# EasyEDA schematic 1-Schematic_TRIAC Dimmer.json
TITLE: Sheet_1; REV: 1.0; Date: 2021-07-04; Sheet: 1/1; Drawn By: Manuel Covas; Company: Your Company
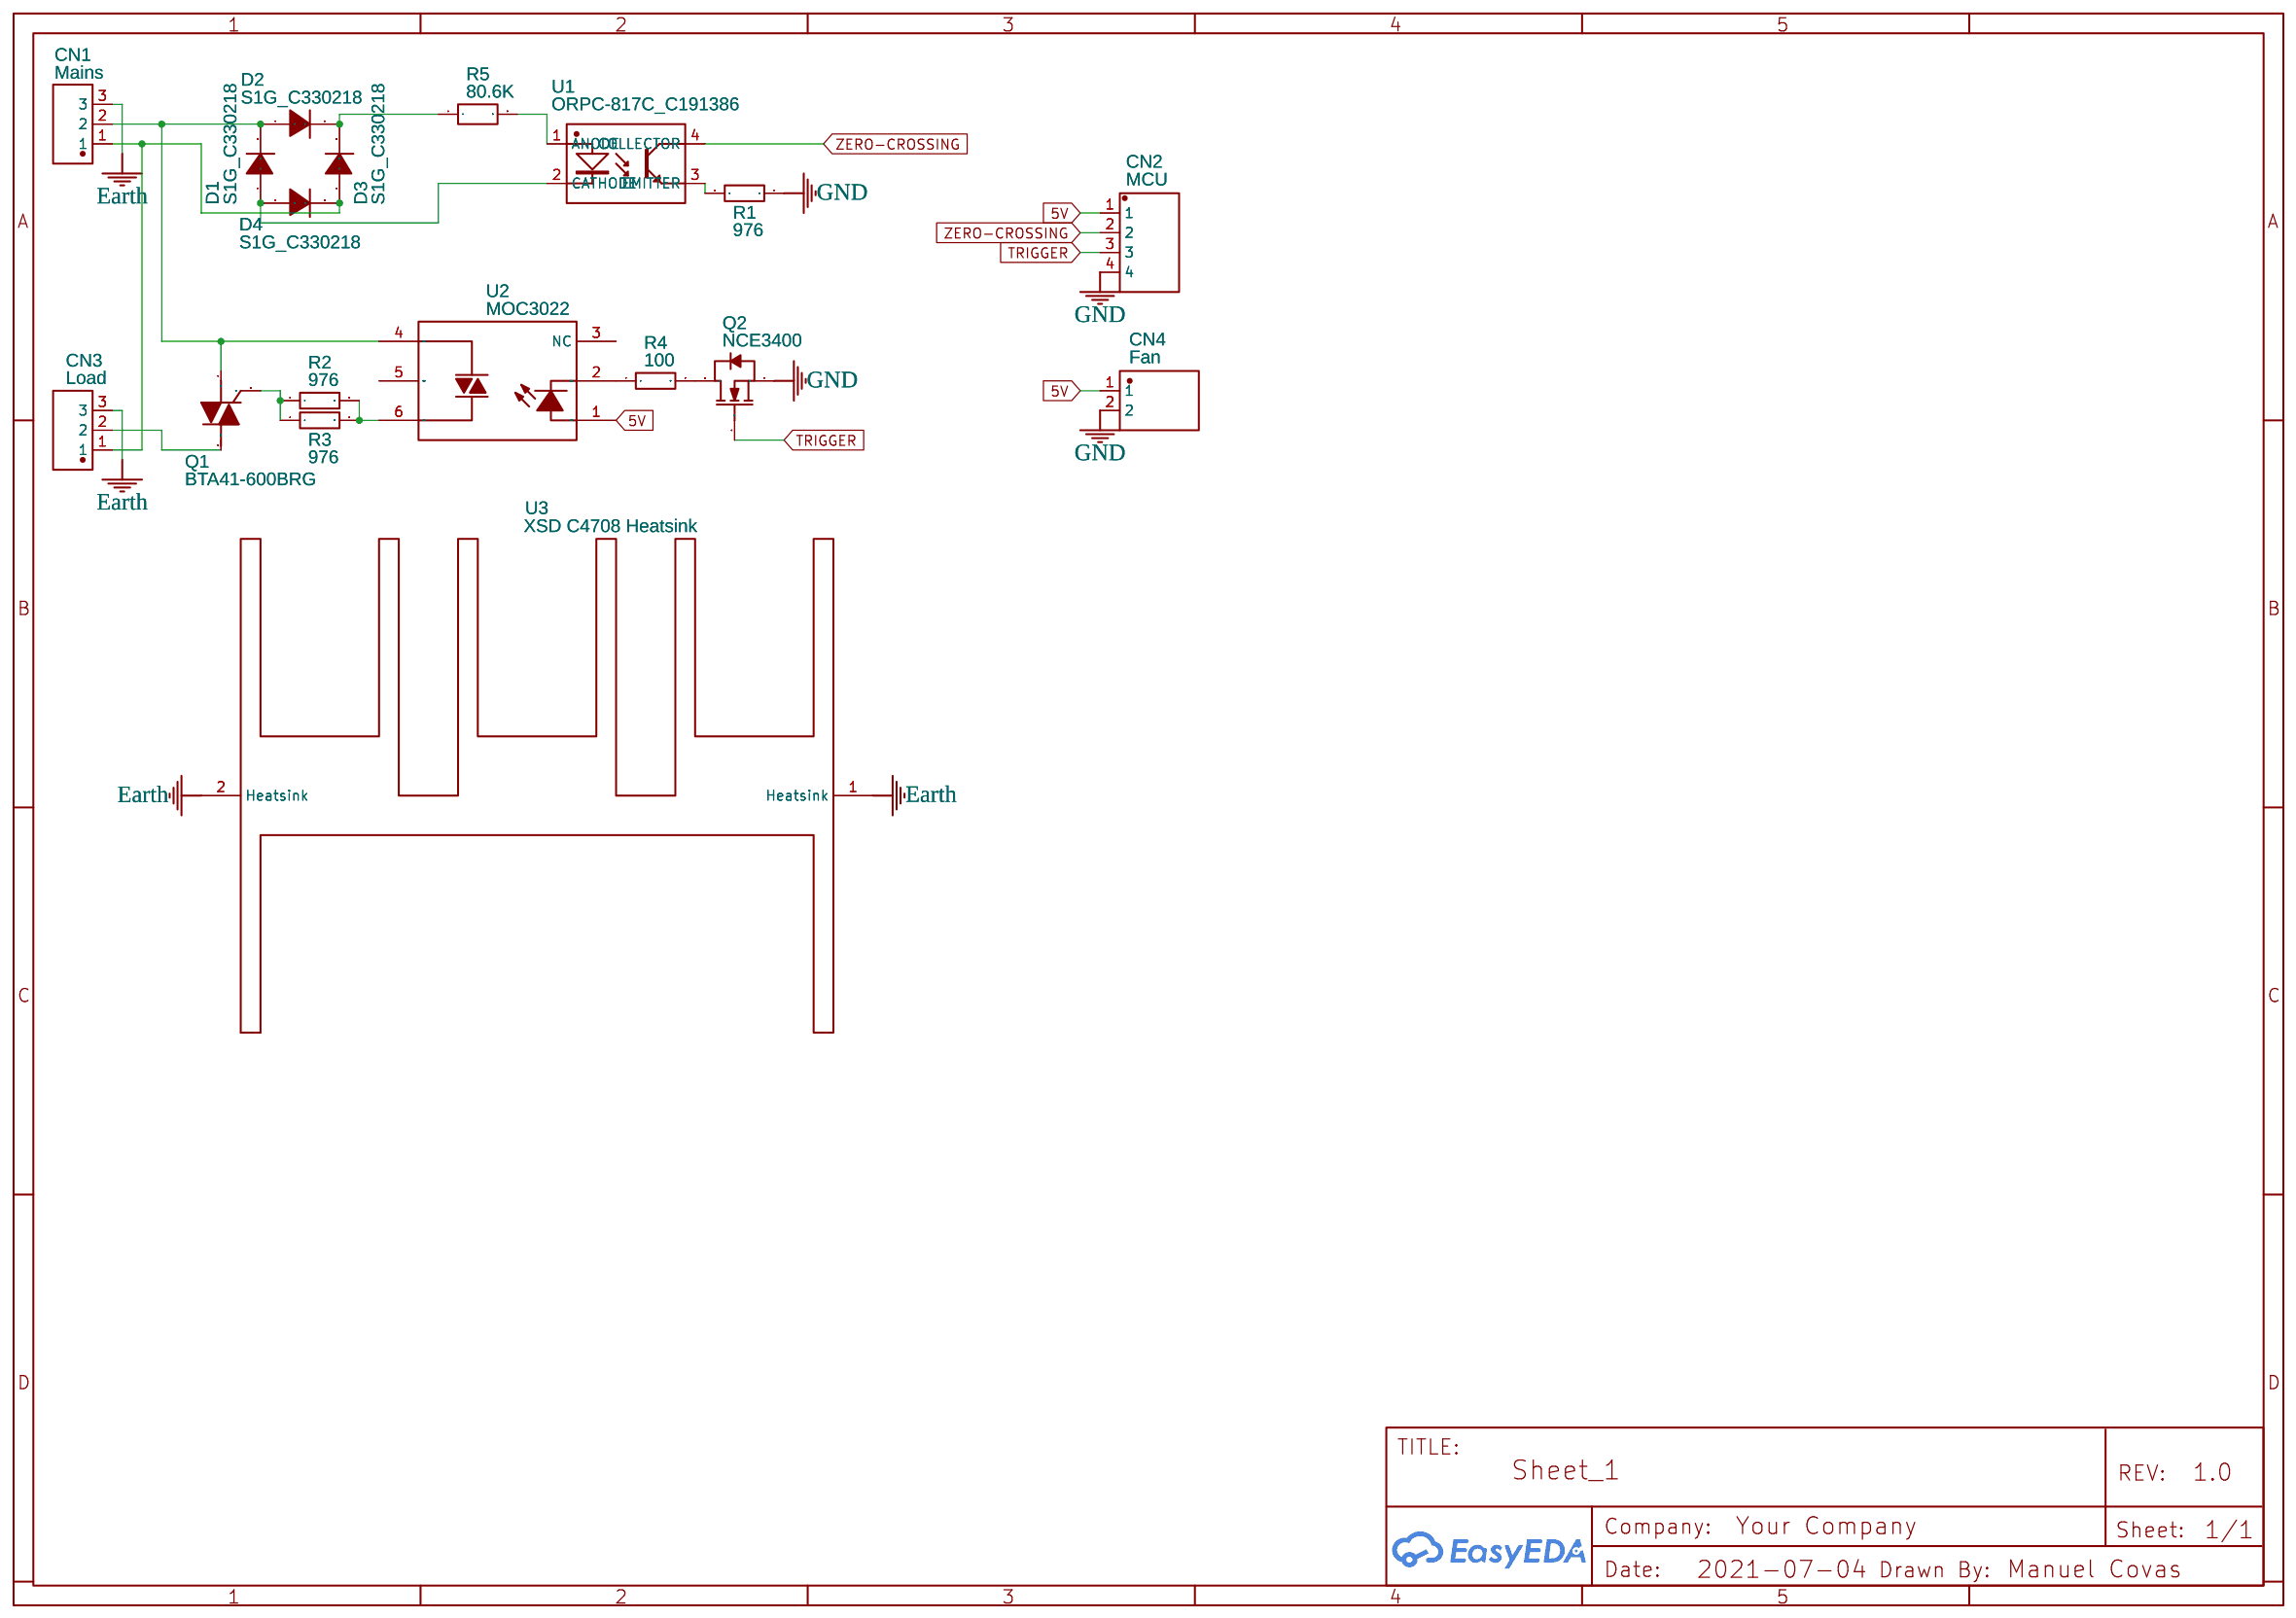
[diagram p0: schematic sheet]

## Parts
CN1  Mains  [CONN-TH_3P-P5.00_KF301-5.0-3P]
CN2  MCU  [CONN-TH_B4B-XH-AM-LF-SN]
CN3  Load  [CONN-TH_3P-P5.00_KF301-5.0-3P]
CN4  Fan  [CONN-TH_B2B-XH-AM-LF-SN]
D1  S1G_C330218  [SMA_L4.3-W2.6-LS5.2-FD]
D2  S1G_C330218  [SMA_L4.3-W2.6-LS5.2-FD]
D3  S1G_C330218  [SMA_L4.3-W2.6-LS5.2-FD]
D4  S1G_C330218  [SMA_L4.3-W2.6-LS5.2-FD]
Q1  BTA41-600BRG  [TOP3_L15.3-W4.5-P5.60-L]
Q2  NCE3400  [SOT-23-3_L2.9-W1.6-P1.90-LS2.8-BR]
R1  976  [R1206]
R2  976  [R1206]
R3  976  [R1206]
R4  100  [R0805]
R5  80.6K  [R2512]
U1  ORPC-817C_C191386  [DIP-4_L6.4-W4.6-P2.54-LS7.6-BL]
U2  MOC3022  [DIP-6_L7.1-W6.5-P2.54-LS7.6-BL]
U3  XSD C4708 Heatsink  [XSD C4708 HEATSINK]

## Library data of the parts
CN1 CN3 = KF301-5.0-3P: Supplier: LCSC; Supplier Part: C474882; Manufacturer: Cixi Kefa Elec; Contributor: LCSC; JLCPCB Part Class: Extended Part
CN2 = B4B-XH-AM(LF)(SN): Supplier: LCSC; Supplier Part: C161871; Manufacturer: JST Sales America; Contributor: LCSC; JLCPCB Part Class: Extended Part
CN4 = B2B-XH-AM (LF)(SN): Supplier: LCSC; Supplier Part: C161869; Manufacturer: JST Sales America; Contributor: LCSC; JLCPCB Part Class: Extended Part
D1-D4 = S1G_C330218: Supplier: LCSC; Supplier Part: C330218; Manufacturer: LGE; Contributor: LCSC; JLCPCB Part Class: Extended Part
Q1 = BTA41-600BRG: Supplier: LCSC; Manufacturer: STMicroelectronics; Contributor: LCSC; Supplier Part: C9103; JLCPCB Part Class: Extended Part
Q2 = NCE3400: Supplier: LCSC; Manufacturer: Ncepower; Supplier Part: C113202; JLCPCB Part Class: Extended Part
R1-R3 = AC1206FR-07976RL: Supplier: LCSC; Supplier Part: C229856; Manufacturer: YAGEO; Contributor: LCSC; JLCPCB Part Class: Extended Part
R4 = RMC1/10K101FTP: Supplier: LCSC; Supplier Part: C340501; Manufacturer: KAMAYA; Contributor: LCSC
R5 = 25121WF8062T4E: Supplier: LCSC; Supplier Part: C406917; Manufacturer: Uniroyal Elec; Contributor: LCSC
U1 = ORPC-817C_C191386: Supplier: LCSC; Supplier Part: C191386; Manufacturer: Orient; Manufacturer Part: ORPC-817C; Contributor: LCSC; JLCPCB Part Class: Extended Part
U2 = MOC3022: Supplier: LCSC; Manufacturer: LITEON; Contributor: LCSC; Supplier Part: C115466; JLCPCB Part Class: Extended Part
U3 = XSD C4708 Heatsink: Manufacturer: XSD; Manufacturer Part: C4708; Supplier: LCSC; Supplier Part: C4708; link: https://lcsc.com/product-detail/Heat-Sinks_XSD-30-25-25-True-color1Hole-heat-sink_C4708.html; Contributor: Manuel Covas

## Nets
5V: CN2.1 CN4.1 U2.1(ANODE)
GND: CN2.4 CN4.2 Q2.2(S) R1.1
Earth: CN1.3 CN3.3 U3.1(Heatsink) U3.2(Heatsink)
TRIGGER: CN2.3 Q2.1(G)
ZERO-CROSSING: CN2.2 U1.4(COLLECTOR)
Net-(CN1-1): CN1.1 CN3.1 D3.1 D4.2
Net-(CN1-2): CN1.2 D1.2 D2.1 Q1.1(M1) U2.4( Terminal)
Net-(CN3-2): CN3.2 Q1.2(M2)
Net-(D1-1): D1.1 D4.1 U1.2(CATHODE)
Net-(D2-2): D2.2 D3.2 R5.1
Net-(Q1-3): Q1.3(G) R2.1 R3.1
Net-(Q2-3): Q2.3(D) R4.2
Net-(R1-2): R1.2 U1.3(EMITTER)
Net-(R2-2): R2.2 R3.2 U2.6(Terminal )
Net-(R4-1): R4.1 U2.2(Cathode )
Net-(R5-2): R5.2 U1.1(ANODE)

Not connected (* = marked no-connect by the designer): U2 3(NC) 5(Substrate )
